# EAGLE schematic Motor PI (EAGLE 9.6.2)
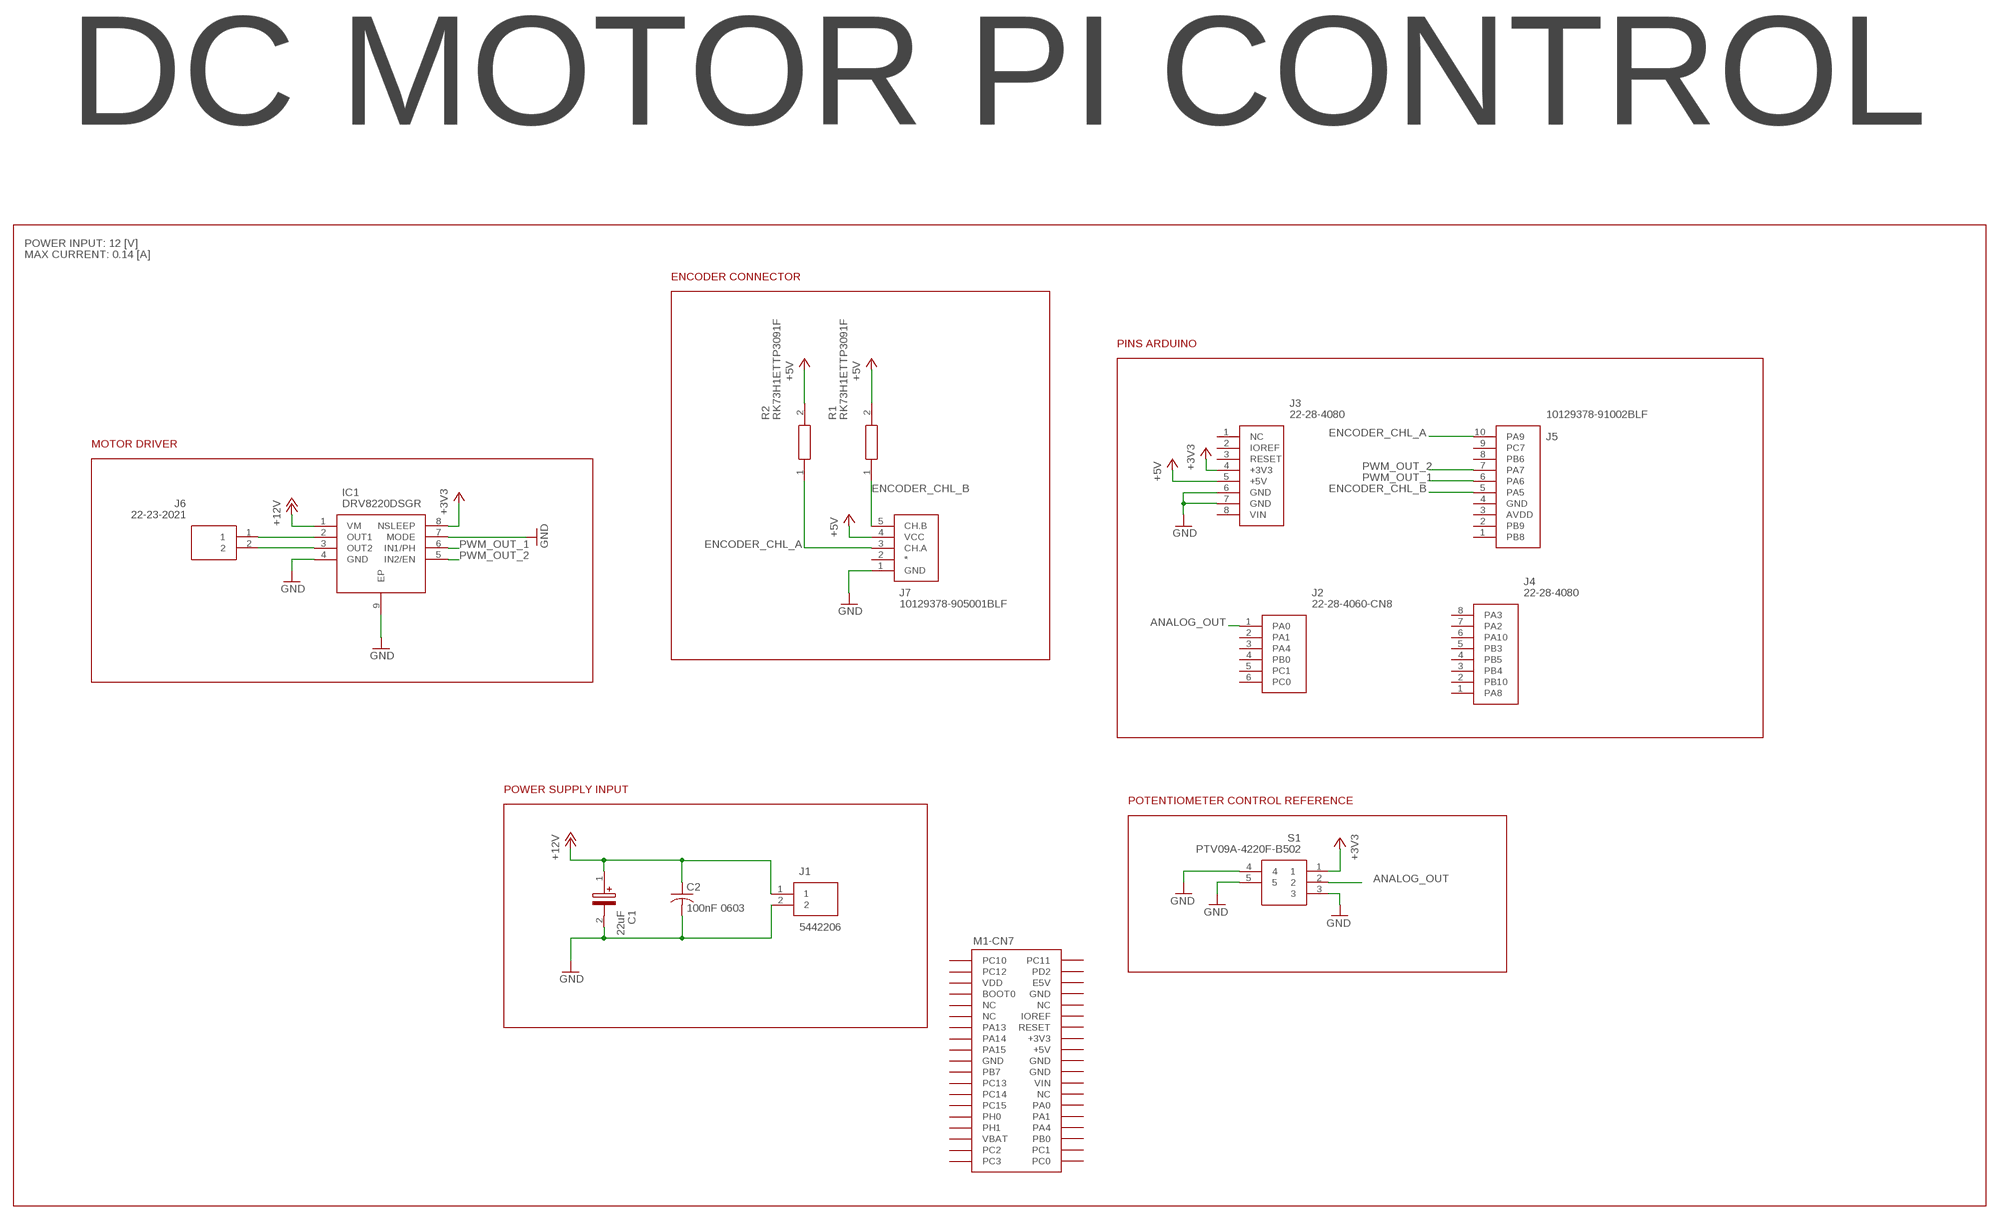
[diagram p0: schematic, sheet 1]

## Parts
C1  22uF  860020472004  [CAPPRD200W52D500H1250]
C2  100nF 0603  C-USC0603  [C0603]
IC1  DRV8220DSGR  [SON50P200X200X80-9N]
J1  5442206  [5442206]
J2  22-28-4060-CN8  [HDRV6W66P0X254_1X6_1524X249X83-CN8]
J3  22-28-4080  [HDRV6W66P0X254_1X6_1524X249X83]
J4  22-28-4080  [HDRV6W66P0X254_1X6_1524X249X83]
J5  10129378-91002BLF  [HDRV6W66P0X254_1X6_1524X249X83]
J6  22-23-2021  [SHDR2W87P0X254_1X2_493X635X110]
J7  10129378-905001BLF  [HDRV6W66P0X254_1X6_1524X249X83]
M1  NUCLEO-L452RE  [NUCLEO-64]
R1  RK73H1ETTP3091F  [RESC1005X40N]
R2  RK73H1ETTP3091F  [RESC1005X40N]
S1  PTV09A-4220F-B502  [PTV09A4020FB103]

## Nets
+3V3: IC1.8(NSLEEP) J3.4(+3V3) S1.1
+5V: J3.5(+5V) J7.4(VCC) R1.2 R2.2
+12V: C1.1(+) C2.1 IC1.1(VM) J1.1
ANALOG_OUT: J2.1(PA0) S1.2
ENCODER_CHL_A: J5.10(PA9) J7.3(CH.A) R2.1
ENCODER_CHL_B: J5.5(PA5) J7.5(CH.B) R1.1
GND: C1.2(-) C2.2 IC1.4(GND) IC1.7(MODE) IC1.9(EP) J1.2 J3.6(GND) J3.7(GND) J7.1(GND) S1.3 S1.4 S1.5
N$1: IC1.2(OUT1) J6.1
N$2: IC1.3(OUT2) J6.2
PWM_OUT_1: IC1.6(IN1/PH) J5.6(PA6)
PWM_OUT_2: IC1.5(IN2/EN) J5.7(PA7)
Unconnected: J2.2(PA1) J2.3(PA4) J2.4(PB0) J2.5(PC1) J2.6(PC0) J3.1(NC) J3.2(IOREF) J3.3(RESET) J3.8(VIN) J4.1(PA8) J4.2(PB10) J4.3(PB4) J4.4(PB5) J4.5(PB3) J4.6(PA10) J4.7(PA2) J4.8(PA3) J5.1(PB8) J5.2(PB9) J5.3(AVDD) J5.8(PB6) J5.9(PC7) J7.2(*) M1.CN5-1(-CN5:PA9) M1.CN5-2(-CN5:PC7) M1.CN5-3(-CN5:PB6) M1.CN5-4(-CN5:PA7) M1.CN5-5(-CN5:PA6) M1.CN5-6(-CN5:PA5) M1.CN5-9(-CN5:PB9) M1.CN5-10(-CN5:PB8) M1.CN6-1(-CN6:NC) M1.CN6-3(-CN6:RESET) M1.CN7-1(-CN7:PC10) M1.CN7-2(-CN7:PC11) M1.CN7-3(-CN7:PC12) M1.CN7-4(-CN7:PD2) M1.CN7-6(-CN7:E5V) M1.CN7-7(-CN7:BOOT0) M1.CN7-9(-CN7:NC) M1.CN7-10(-CN7:NC) M1.CN7-11(-CN7:NC) M1.CN7-12(-CN7:IOREF) M1.CN7-13(-CN7:PA13) M1.CN7-14(-CN7:RESET) M1.CN7-15(-CN7:PA14) M1.CN7-17(-CN7:PA15) M1.CN7-21(-CN7:PB7) M1.CN7-23(-CN7:PC13) M1.CN7-25(-CN7:PC14) M1.CN7-26(-CN7:NC) M1.CN7-27(-CN7:PC15) M1.CN7-28(-CN7:PA0) M1.CN7-29(-CN7:PH0) M1.CN7-30(-CN7:PA1) M1.CN7-31(-CN7:PH1) M1.CN7-32(-CN7:PA4) M1.CN7-34(-CN7:PB0) M1.CN7-35(-CN7:PC2) M1.CN7-36(-CN7:PC1) M1.CN7-37(-CN7:PC3) M1.CN7-38(-CN7:PC0) M1.CN8-1(-CN8:PA0) M1.CN8-2(-CN8:PA1) M1.CN8-3(-CN8:PA4) M1.CN8-4(-CN8:PB0) M1.CN8-5(-CN8:PC1) M1.CN8-6(-CN8:PC0) M1.CN9-1(-CN9:PA3) M1.CN9-2(-CN9:PA2) M1.CN9-3(-CN9:PA10) M1.CN9-4(-CN9:PB3) M1.CN9-5(-CN9:PB5) M1.CN9-6(-CN9:PB4) M1.CN9-7(-CN9:PB10) M1.CN9-8(-CN9:PA8) M1.CN10-1(-CN10:PC9) M1.CN10-2(-CN10:PC8) M1.CN10-3(-CN10:PB8) M1.CN10-4(-CN10:PC6) M1.CN10-5(-CN10:PB9) M1.CN10-6(-CN10:PC5) M1.CN10-10(-CN10:NC) M1.CN10-11(-CN10:PA5) M1.CN10-12(-CN10:PA12) M1.CN10-13(-CN10:PA6) M1.CN10-14(-CN10:PA11) M1.CN10-15(-CN10:PA7) M1.CN10-16(-CN10:PB12) M1.CN10-17(-CN10:PB6) M1.CN10-18(-CN10:PB11) M1.CN10-19(-CN10:PC7) M1.CN10-21(-CN10:PA9) M1.CN10-22(-CN10:PB2) M1.CN10-23(-CN10:PA8) M1.CN10-24(-CN10:PB1) M1.CN10-25(-CN10:PB10) M1.CN10-26(-CN10:PB15) M1.CN10-27(-CN10:PB4) M1.CN10-28(-CN10:PB14) M1.CN10-29(-CN10:PB5) M1.CN10-30(-CN10:PB13) M1.CN10-31(-CN10:PB3) M1.CN10-33(-CN10:PA10) M1.CN10-34(-CN10:PC4) M1.CN10-35(-CN10:PA2) M1.CN10-36(-CN10:NC) M1.CN10-37(-CN10:PA3) M1.CN10-38(-CN10:NC)

## Notes on the sheet
- DC MOTOR PI CONTROL
- POWER INPUT: 12 [V]
- MAX CURRENT: 0.14 [A]
- ENCODER CONNECTOR
- PINS ARDUINO
- MOTOR DRIVER
- POWER SUPPLY INPUT
- POTENTIOMETER CONTROL REFERENCE

## Power pins joined to a net without a drawn wire
+3V3: M1.CN6-4(-CN6:+3V3) M1.CN7-16(-CN7:+3V3)
+5V: M1.CN6-5(-CN6:+5V) M1.CN7-18(-CN7:+5V)
AGND: M1.CN10-32(-CN10:AGND)
AVDD: M1.CN5-8(-CN5:AVDD) M1.CN10-7(-CN10:AVDD)
GND: J5.4(GND) M1.CN5-7(-CN5:GND) M1.CN6-6(-CN6:GND) M1.CN6-7(-CN6:GND) M1.CN7-8(-CN7:GND) M1.CN7-19(-CN7:GND) M1.CN7-20(-CN7:GND) M1.CN7-22(-CN7:GND) M1.CN10-9(-CN10:GND) M1.CN10-20(-CN10:GND)
IOREF: M1.CN6-2(-CN6:IOREF)
U5V: M1.CN10-8(-CN10:U5V)
VBAT: M1.CN7-33(-CN7:VBAT)
VDD: M1.CN7-5(-CN7:VDD)
VIN: M1.CN6-8(-CN6:VIN) M1.CN7-24(-CN7:VIN)

## Library data of the parts
C1 = 860020472004:860020472004: Wurth Elektronik 22uF 25 V dc Aluminium Electrolytic Capacitor, WCAP-ATG5 Series 2000h 5 (Dia.) x 11mm Source: Datasheet <https://componentsearchengine.com/Datasheets/1/860020472004.pdf>; DESCRIPTION: Wurth Elektronik 22uF 25 V dc Aluminium Electrolytic Capacitor, WCAP-ATG5 Series 2000h 5 (Dia.) x 11mm; HEIGHT: 12.5mm; MANUFACTURER_NAME: Wurth Elektronik; MANUFACTURER_PART_NUMBER: 860020472004; MOUSER_PART_NUMBER: 710-860020472004; MOUSER_PRICE-STOCK: https://www.mouser.co.uk/ProductDetail/Wurth-Elektronik/860020472004?qs=0KOYDY2FL29mXlSSkQ%2FGXA%3D%3D; PARTNO: 860020472004
C2 = rcl:C-US: CAPACITOR, American symbol; SPICEPREFIX: C
IC1 = DRV8220DSGR:DRV8220DSGR: DRV8220DSGR Source: Datasheet <https://www.ti.com/lit/gpn/drv8220>; DESCRIPTION: DRV8220DSGR; HEIGHT: 0.8mm; MANUFACTURER_NAME: Texas Instruments; MANUFACTURER_PART_NUMBER: DRV8220DSGR; PARTNO: DRV8220DSGR
J1 = 5442206 - PHOENIX CONNECTOR:5442206: Fixed Terminal Blocks BC-508X10- 2 GN 5.08 MM PITCH Source: Datasheet <http://www.phoenixcontact.net/product/5442206>; DESCRIPTION: Fixed Terminal Blocks BC-508X10- 2 GN 5.08 MM PITCH; HEIGHT: 10.15mm; MANUFACTURER_NAME: Phoenix Contact; MANUFACTURER_PART_NUMBER: 5442206; MOUSER_PART_NUMBER: 651-5442206; MOUSER_PRICE-STOCK: https://www.mouser.co.uk/ProductDetail/Phoenix-Contact/5442206?qs=9Y9qB%2FCsC3mwFPD7AAIe1g%3D%3D; PARTNO: 5442206
J2 = 22-28-4060-CN8:22-28-4060-CN8: MOLEX - 22-28-4060 - CONNECTOR, HEADER, 6POS, 1ROW, 2.54MM Source: Datasheet <https://www.molex.com/pdm_docs/sd/022284060_sd.pdf>; DESCRIPTION: MOLEX - 22-28-4060 - CONNECTOR, HEADER, 6POS, 1ROW, 2.54MM; HEIGHT: 8.38mm; MANUFACTURER_NAME: Molex; MANUFACTURER_PART_NUMBER: 22-28-4060; MOUSER_PART_NUMBER: 538-22-28-4060; MOUSER_PRICE-STOCK: https://www.mouser.co.uk/ProductDetail/Molex/22-28-4060?qs=d9fIA1aNikSACgwI0d%252BTOw%3D%3D; PARTNO: 22-28-4060
J3 = 22-28-4080-CN6:22-28-4080: MOLEX - 22-28-4080 - CONNECTOR, HEADER, 8POS, 1ROW, 2.54MM
J4 = 22-28-4080-CN9:22-28-4080: MOLEX - 22-28-4080 - CONNECTOR, HEADER, 8POS, 1ROW, 2.54MM; PARTNO: 22-28-4080
J5 = 10129378-91002BLF-CN5:10129378-91002BLF: MOLEX - 22-28-4080 - CONNECTOR, HEADER, 8POS, 1ROW, 2.54MM
J6 = 22-23-2021:22-23-2021: Headers & Wire Housings VERT PCB HDR 2P TIN FRICTION LOCK Source: Datasheet; DESCRIPTION: Headers & Wire Housings VERT PCB HDR 2P TIN FRICTION LOCK; HEIGHT: 11.05mm; MANUFACTURER_NAME: Molex; MANUFACTURER_PART_NUMBER: 22-23-2021; MOUSER_PART_NUMBER: 538-22-23-2021; MOUSER_PRICE-STOCK: https://www.mouser.co.uk/ProductDetail/Molex/22-23-2021?qs=ILqg114nvd4YKlRlbo3yMg%3D%3D; PARTNO: 22-23-2021
J7 = 10129378-905001BLF:10129378-905001BLF: 10129378-905001BLF; PARTNO: 10129378-905001BLF
M1 = NUCLEO-L452RE:NUCLEO-L452RE: No existe un outline (Layer Dimension) para esta librería. En su lugar se utilizó una referencia en tDocu. Al momento de diseñar la tarjeta, el Dimension debe ser dibujado según los requerimientos del usuario, o simplemente copiar los contenidos del tDocu en Dimensions.
R1 R2 = RK73H1ETTP3091F:RK73H1ETTP3091F: Thick Film Resistors - SMD 0.1watts 3.09Kohms Source: Datasheet <https://componentsearchengine.com/Datasheets/1/RK73H1ETTP3091F.pdf>; DESCRIPTION: Thick Film Resistors - SMD 0.1watts 3.09Kohms; HEIGHT: 0.4mm; MANUFACTURER_NAME: KOA Speer; MANUFACTURER_PART_NUMBER: RK73H1ETTP3091F; MOUSER_PART_NUMBER: 660-RK73H1ETTP3091F; MOUSER_PRICE-STOCK: https://www.mouser.com/Search/Refine.aspx?Keyword=660-RK73H1ETTP3091F; PARTNO: RK73H1ETTP3091F
S1 = PTV09A-4220F-B502:PTV09A-4220F-B502: Potentiometers 5K LINEAR 20% Source: Datasheet <https://www.bourns.com/pdfs/PTV09.pdf>; DESCRIPTION: Potentiometers 5K LINEAR 20%; HEIGHT: 20mm; MANUFACTURER_NAME: Bourns; MANUFACTURER_PART_NUMBER: PTV09A-4220F-B502; MOUSER_PART_NUMBER: 652-PTV09A-4220FB502; MOUSER_PRICE-STOCK: https://www.mouser.co.uk/ProductDetail/Bourns/PTV09A-4220F-B502?qs=Qzws7J6gxqy3MGe1ZYljGQ%3D%3D; PARTNO: PTV09A-4220F-B103